# Altium project Auto-Watering-System.PrjPcb
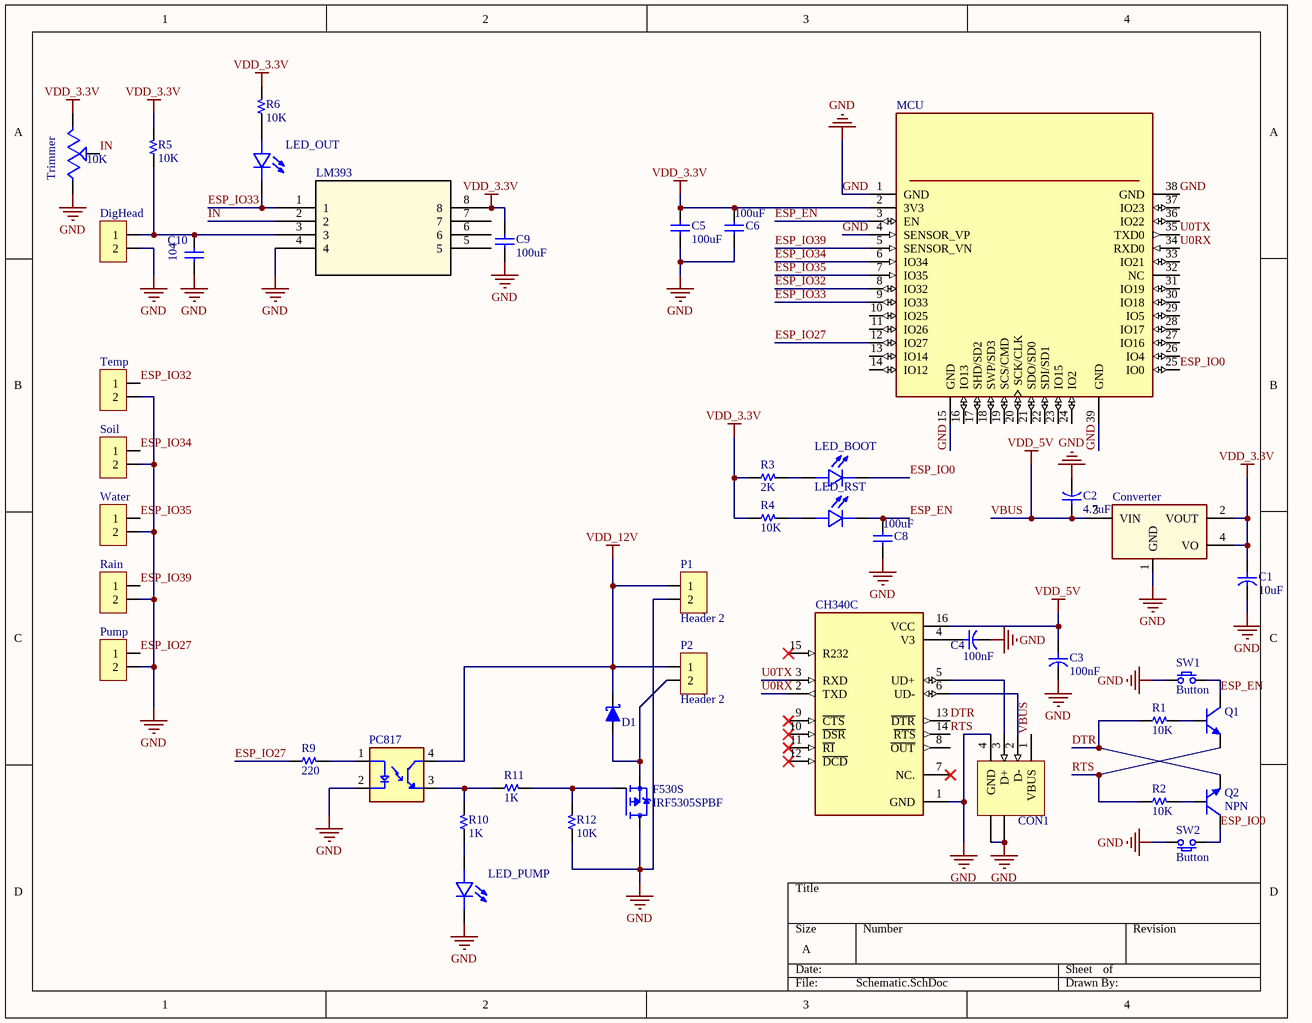
[diagram p0: Schematic.SchDoc]
1 sheet, 44 parts. Net scope: global (net labels, ports and power ports of the same name join across sheets).
Board file: PCB1.PcbDoc

## Sheet Schematic.SchDoc
size A; SheetNumber: 1; SheetTotal: 1

### Parts
C1  10uF  [C SMD TAN 1206 (A)]
C2  4.7uF  [C SMD TAN 1206 (A)]
C3  100nF  [C SMD TAN 1206 (A)]
C4  100nF  [C SMD TAN 1206 (A)]
C5  100uF  [C 0805]
C6  100uF  [C 0805]
C8  100uF  [C 0805]
C9  100uF  [C 0805]
C10  104  [C 0805]
CH340C  USB to UART  [SOIC127P600X180-16N]  (value not drawn)  (net tie, no BOM)
CON1  USB Type A  [CONN/USB/A/FEMALE/RA]  (value not drawn)
Converter  1117-3.3  [SOT-223]  (value not drawn)
D1  Diode Schottky  [DO-41]  (value not drawn)
DigHead  Header 2  [HDR/Header/2/2mm]  (value not drawn)
F530S  IRF5305SPBF  [TO254P1524X483-4N]
LED_BOOT  VLMS1300-GS08  [LED_VLMS1300-GS08]  (value not drawn)
LED_OUT  VLMS1300-GS08  [LED_VLMS1300-GS08]  (value not drawn)
LED_PUMP  VLMS1300-GS08  [LED_VLMS1300-GS08]  (value not drawn)
LED_RST  VLMS1300-GS08  [LED_VLMS1300-GS08]  (value not drawn)
LM393  Comparator  [DIP8_300]  (value not drawn)
MCU  ESP32-WROOM-32  [MODULE_ESP32-WROOM-32]  (value not drawn)
P1  Header 2  [HDR/Terminal/2]
P2  Header 2  [HDR/Terminal/2]
PC817  PC817X2NIP1B  [SOIC254P960X420-4N]  (value not drawn)
Pump  Header 2  [HDR/Header/2/2mm]  (value not drawn)
Q1  NPN  [SOT-23]  (value not drawn)
Q2  NPN  [SOT-23]
R1  10K  [R 0402]
R2  10K  [R 0402]
R3  2K  [R 0402]
R4  10K  [R 0402]
R5  10K  [R 0402]
R6  10K  [R 0402]
R9  220  [R 0402]
R10  1K  [R 0402]
R11  1K  [R 0402]
R12  10K  [R 0402]
Rain  Header 2  [HDR/Header/2/2mm]  (value not drawn)
Soil  (no value)  [HDR/Header/2/2mm]
SW1  Button  [SW/2/DIP]
SW2  Button  [SW/2/DIP]
Temp  Temp Sensor  [HDR/Header/2/2mm]  (value not drawn)
Trimmer  10K  [TRIM_3386F-1-103T]
Water  Header 2  [HDR/Header/2/2mm]  (value not drawn)

### Nets
GND: C1.2 C2.2 C3.2 C4.2 C5.2 C6.2 C8.2 C9.2 C10.2 CH340C.1(GND) CON1.4(GND) CON1.5(SHLD) CON1.6(SHLD) Converter.1(GND) DigHead.2 F530S.4(D) LED_PUMP.C LM393.4 MCU.1(GND) MCU.4(SENSOR_VP) MCU.15(GND) MCU.38(GND) MCU.39(GND) P1.2 PC817.2(C) Pump.2 R12.1 Rain.2 Soil.2 SW1.1 SW2.2 Temp.2 Trimmer.1(CCW) Water.2
VBUS: C2.1 C3.1 CH340C.16(VCC) CON1.1(VBUS) Converter.3(VIN)  [also labelled VDD_5V]
VDD_3.3V: C1.1 C5.1 C6.1 C9.1 Converter.2(VOUT) Converter.4(VO) LM393.8 MCU.2(3V3) R3.1 R4.1 R5.2 R6.2 Trimmer.3(CW)
VDD_12V: D1.2(K) P1.1 P2.1 PC817.4(CT)
DTR: CH340C.13(~{DTR}) Q2.2(E) R1.1
ESP_EN: C8.1 LED_RST.C MCU.3(EN) Q1.3(C) SW1.2
ESP_IO0: LED_BOOT.C MCU.25(IO0) Q2.3(C) SW2.1
ESP_IO27: MCU.12(IO27) Pump.1 R9.1
ESP_IO32: MCU.8(IO32) Temp.1
ESP_IO33: LED_OUT.C LM393.1 MCU.9(IO33)
ESP_IO34: MCU.6(IO34) Soil.1
ESP_IO35: MCU.7(IO35) Water.1
ESP_IO39: MCU.5(SENSOR_VN) Rain.1
IN: LM393.2 Trimmer.2(WIPER)
RTS: CH340C.14(~{RTS}) Q1.2(E) R2.1
U0RX: CH340C.2(TXD) MCU.34(RXD0)
U0TX: CH340C.3(RXD) MCU.35(TXD0)
NetC4_1: C4.1 CH340C.4(V3)
NetC10_1: C10.1 DigHead.1 LM393.3 R5.1
NetCH340C_5: CH340C.5(UD+) CON1.3(D+)
NetCH340C_6: CH340C.6(UD-) CON1.2(D-)
NetD1_1: D1.1(A) F530S.3(S) P2.2
NetF530S_1: F530S.1(G) R11.2 R12.2
NetLED_BOOT_A: LED_BOOT.A R3.2
NetLED_OUT_A: LED_OUT.A R6.1
NetLED_PUMP_A: LED_PUMP.A R10.1
NetLED_RST_A: LED_RST.A R4.2
NetPC817_1: PC817.1(A) R9.2
NetPC817_3: PC817.3(ET) R10.2 R11.1
NetQ1_1: Q1.1(B) R1.2
NetQ2_1: Q2.1(B) R2.2

Not connected (* = marked no-connect by the designer): CH340C 7(NC.)* 8(~{OUT}) 9(~{CTS})* 10(~{DSR})* 11(~{RI})* 12(~{DCD})* 15(R232)*; LM393 5 6 7; MCU 10(IO25) 11(IO26) 13(IO14) 14(IO12) 16(IO13) 17(SHD/SD2) 18(SWP/SD3) 19(SCS/CMD) 20(SCK/CLK) 21(SDO/SD0) 22(SDI/SD1) 23(IO15) 24(IO2) 26(IO4) 27(IO16) 28(IO17) 29(IO5) 30(IO18) 31(IO19) 32(NC) 33(IO21) 36(IO22) 37(IO23)

### Library data of the parts
C1-C4 = Capacitor: Capacitor pol
C5 C6 C8-C10 = Capacitor NP: Capacitor non-pol
CH340C = CH340C: USB to serial chip CH340; MF: WCH; Price: None; Availability: Not in stock; MP: CH340C; Package: None; SnapEDA_Link: https://www.snapeda.com/parts/CH340C/WCH/view-part/?ref=snap; Check_prices: https://www.snapeda.com/parts/CH340C/WCH/view-part/?ref=eda; Value: *
CON1 = CON USB Type A: USB type A, 4 pins
Converter = AMS1117: 1A LDO Voltage Regulator, ADJ or fixed 1.5/1.8/2.5/2.85/3.3/5V
D1 = Diode Schottky: Schottky Diode
DigHead P1 P2 Pump Rain Soil Temp Water = Header 2: Header, 2-Pin
F530S = IRF5305SPBF: RoHS Compliant | Low RDS(on) | Industry-leading quality | Dynamic dv/dt Rating | Fast Switching | Fully Avalanche Rated | 175C Operating Temperature | P-Channel MOSFET; MF: Infineon Technologies; SnapEDA_Link: https://www.snapeda.com/parts/IRF5305SPBF/Infineon/view-part/?ref=snap; Package: D2PAK Infineon; Value: *; MP: IRF5305SPBF; Check_prices: https://www.snapeda.com/parts/IRF5305SPBF/Infineon/view-part/?ref=eda
LM393 = LM393: Description; Manufacturer_Name: Texas Instruments; Copyright: Copyright (C) 2025 Ultra Librarian. All rights reserved.; Manufacturer_Part_Number: LM393; RefDes: RefDes; Type: Type
MCU = ESP32-WROOM-32: Bluetooth, WiFi 802.11b/g/n, Bluetooth v4.2 + EDR, Class 1, 2 and 3 Transceiver Module 2.4GHz ~ 2.5GHz Integrated, Trace Surface Mount; MF: Espressif Systems; MP: ESP32-WROOM-32D; Price: None; Package: Module Espressif Systems; Availability: Unavailable; SnapEDA_Link: https://www.snapeda.com/parts/ESP32-WROOM-32D/Espressif%20Systems/view-part/2768115/?ref=snap; Value: *
PC817 = PC817X2NIP1B: Optocoupler DC-IN 1-CH Transistor DC-OUT 4-Pin DIP SMD T/R; MF: Sharp Microelectronics; SnapEDA_Link: https://www.snapeda.com/parts/PC817X2NIP1B/Sharp+Microelectronics/view-part/?ref=snap; Package: SMD-4 Sharp Microelectronics; Value: *; MP: PC817X2NIP1B; Check_prices: https://www.snapeda.com/parts/PC817X2NIP1B/Sharp+Microelectronics/view-part/?ref=eda
Q1 Q2 = Transistor NPN: NPN Bipolar Transistor
R1-R6 R9-R12 = Resistor
SW1 SW2 = SW SPST: Tact switch 2 pin
Trimmer = 3386F-1-103T: 10 kOhms 0.5W, 1/2W PC Pins Through Hole Trimmer Potentiometer Cermet 1.0 Turn Top Finger Adjustment; MF: Bourns; Purchase-URL: https://pricing.snapeda.com/search/part/3386F-1-103/?ref=eda; Package: 3386F-3 Bourns; Value: *; MP: 3386F-1-103; Availability: In Stock; Price: None; SnapEDA_Link: https://www.snapeda.com/parts/3386F-1-103/Bourns/view-part/?ref=snap; Check_prices: https://www.snapeda.com/parts/3386F-1-103/Bourns/view-part/?ref=eda
LED_BOOT LED_OUT LED_PUMP LED_RST = VLMS1300-GS08: Package: None; Price: None; Value: *; MP: VLMS1300-GS08; Availability: Unavailable